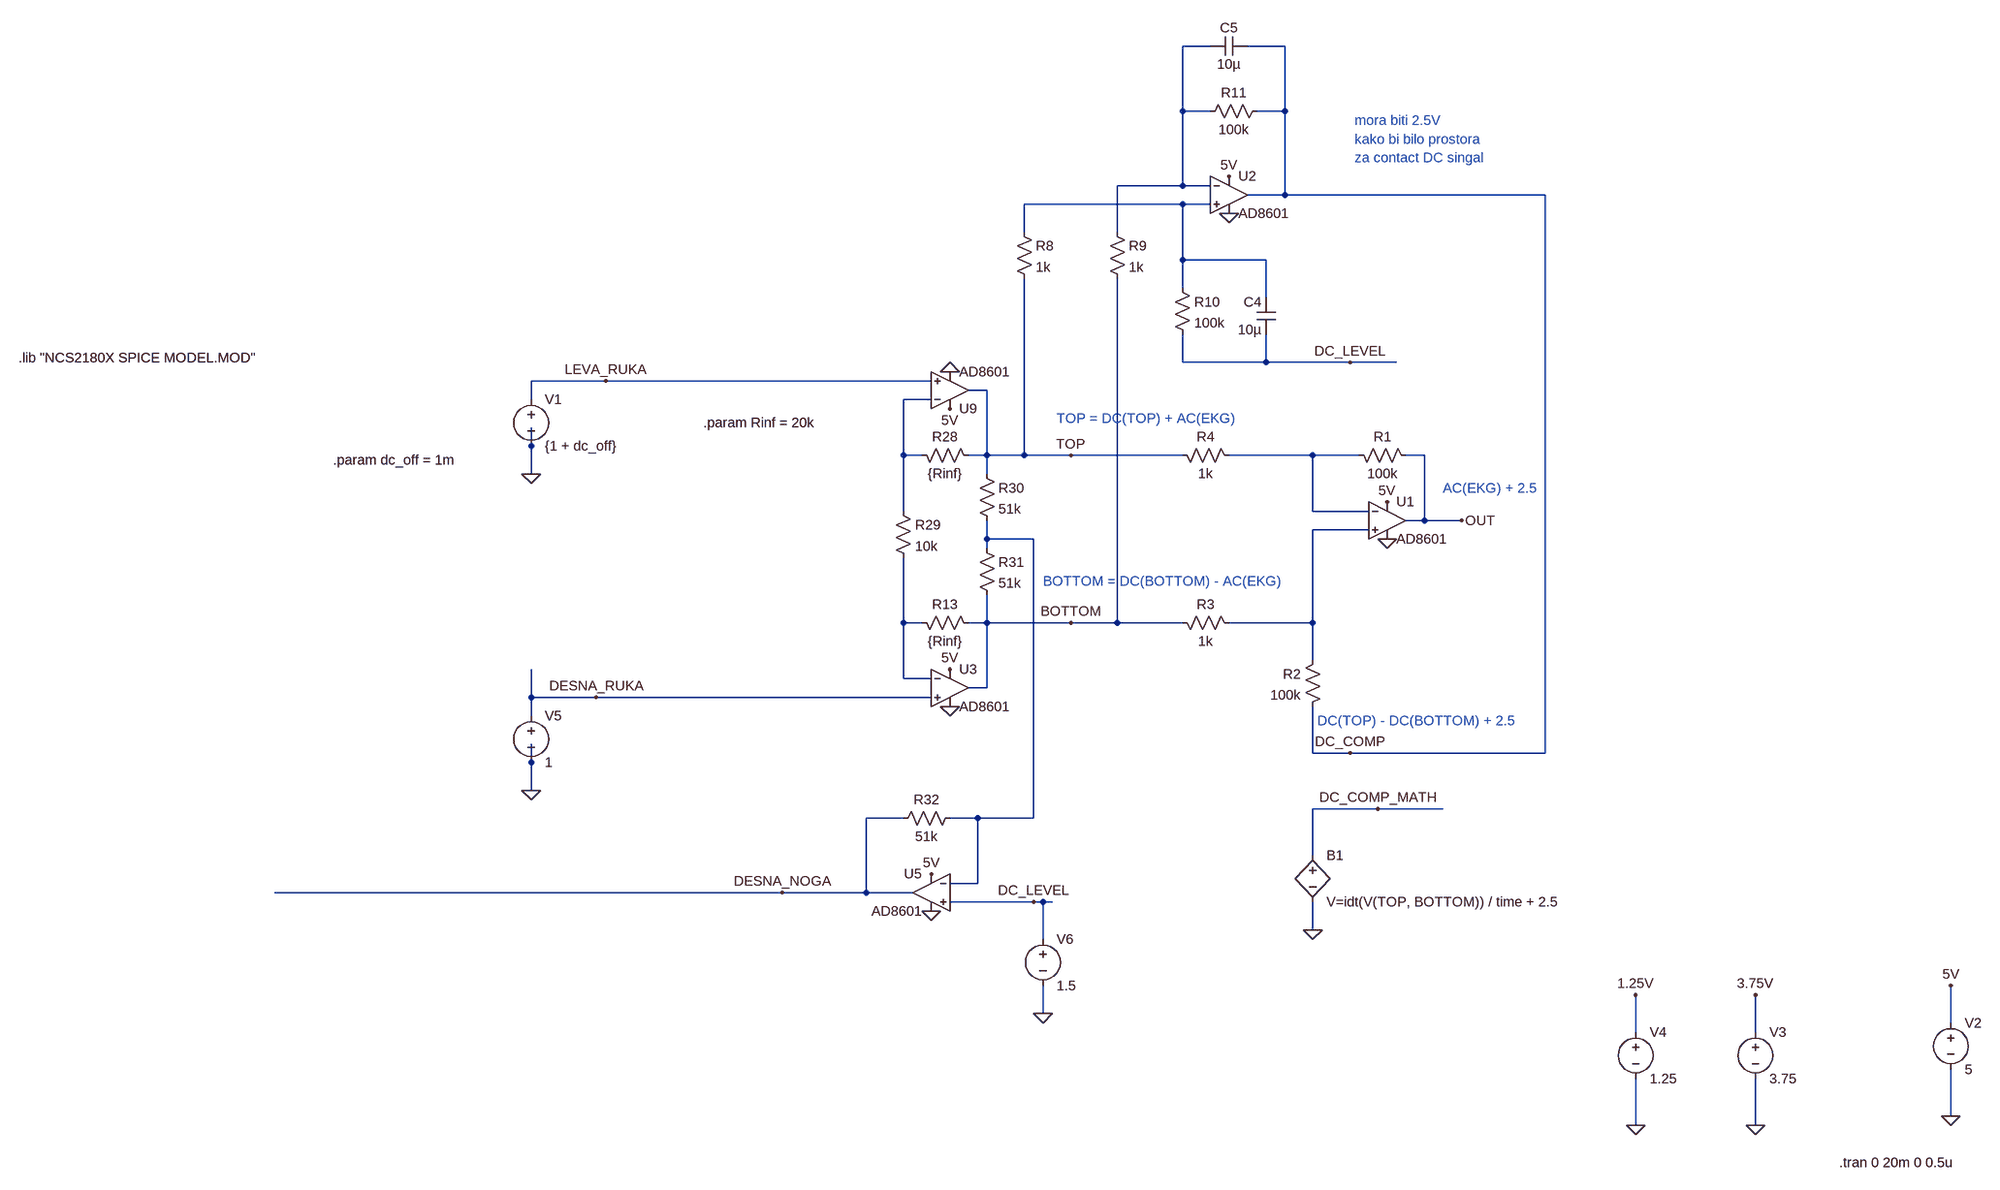
[diagram p0: schematic DC_compensation.asc]
DC_compensation.asc, the LTspice schematic file:
Version 4
SHEET 1 2972 1716
WIRE 0 -736 -48 -736
WIRE 128 -736 64 -736
WIRE -48 -624 -48 -736
WIRE 0 -624 -48 -624
WIRE 128 -624 128 -736
WIRE 128 -624 80 -624
WIRE -48 -496 -48 -624
WIRE -48 -496 -160 -496
WIRE 0 -496 -48 -496
WIRE 128 -480 128 -624
WIRE 128 -480 64 -480
WIRE 576 -480 128 -480
WIRE -48 -464 -320 -464
WIRE 0 -464 -48 -464
WIRE -320 -416 -320 -464
WIRE -160 -416 -160 -496
WIRE -48 -368 -48 -464
WIRE 96 -368 -48 -368
WIRE -48 -320 -48 -368
WIRE 96 -304 96 -368
WIRE -48 -192 -48 -240
WIRE 96 -192 96 -240
WIRE 96 -192 -48 -192
WIRE 240 -192 96 -192
WIRE 320 -192 240 -192
WIRE -1040 -160 -1168 -160
WIRE -480 -160 -1040 -160
WIRE -384 -144 -416 -144
WIRE -1168 -128 -1168 -160
WIRE -480 -128 -528 -128
WIRE -1168 -48 -1168 -80
WIRE -528 -32 -528 -128
WIRE -496 -32 -528 -32
WIRE -384 -32 -384 -144
WIRE -384 -32 -416 -32
WIRE -320 -32 -320 -336
WIRE -320 -32 -384 -32
WIRE -240 -32 -320 -32
WIRE -48 -32 -240 -32
WIRE 176 -32 32 -32
WIRE 256 -32 176 -32
WIRE 368 -32 336 -32
WIRE -1168 0 -1168 -48
WIRE -384 0 -384 -32
WIRE -528 64 -528 -32
WIRE 176 64 176 -32
WIRE 272 64 176 64
WIRE 368 80 368 -32
WIRE 368 80 336 80
WIRE 432 80 368 80
WIRE 272 96 176 96
WIRE -384 112 -384 80
WIRE -304 112 -384 112
WIRE -384 128 -384 112
WIRE -528 256 -528 144
WIRE -496 256 -528 256
WIRE -384 256 -384 208
WIRE -384 256 -416 256
WIRE -240 256 -384 256
WIRE -160 256 -160 -336
WIRE -160 256 -240 256
WIRE -48 256 -160 256
WIRE 176 256 176 96
WIRE 176 256 32 256
WIRE 176 320 176 256
WIRE -528 352 -528 256
WIRE -480 352 -528 352
WIRE -384 368 -384 256
WIRE -384 368 -416 368
WIRE -1168 384 -1168 336
WIRE -1056 384 -1168 384
WIRE -480 384 -1056 384
WIRE -1168 416 -1168 384
WIRE 176 480 176 400
WIRE 240 480 176 480
WIRE 576 480 576 -480
WIRE 576 480 240 480
WIRE -1168 496 -1168 464
WIRE -1168 544 -1168 496
WIRE 288 576 176 576
WIRE 400 576 288 576
WIRE -528 592 -592 592
WIRE -400 592 -448 592
WIRE -304 592 -304 112
WIRE -304 592 -400 592
WIRE 176 656 176 576
WIRE -400 704 -400 592
WIRE -400 704 -448 704
WIRE -736 720 -1616 720
WIRE -592 720 -592 592
WIRE -592 720 -736 720
WIRE -512 720 -592 720
WIRE -304 736 -448 736
WIRE -288 736 -304 736
WIRE -272 736 -288 736
WIRE 176 784 176 736
WIRE -288 800 -288 736
WIRE -288 928 -288 880
WIRE 1760 944 1760 880
WIRE 1168 960 1168 896
WIRE 1424 960 1424 896
WIRE 1760 1104 1760 1024
WIRE 1168 1120 1168 1040
WIRE 1424 1120 1424 1040
FLAG -448 -176 0
FLAG -448 400 0
FLAG 1760 1104 0
FLAG 1760 880 5V
FLAG 304 112 0
FLAG -480 752 0
FLAG -736 720 DESNA_NOGA
FLAG -1040 -160 LEVA_RUKA
FLAG -1056 384 DESNA_RUKA
FLAG -480 688 5V
FLAG -448 336 5V
FLAG 304 48 5V
FLAG -448 -112 5V
FLAG 32 -448 0
FLAG 32 -512 5V
FLAG 1424 1120 0
FLAG 1424 896 3.75V
FLAG 1168 1120 0
FLAG 1168 896 1.25V
FLAG -240 -32 TOP
FLAG -240 256 BOTTOM
FLAG 432 80 OUT
FLAG 240 480 DC_COMP
FLAG 176 784 0
FLAG 288 576 DC_COMP_MATH
FLAG 240 -192 DC_LEVEL
FLAG -304 736 DC_LEVEL
FLAG -1168 0 0
FLAG -1168 544 0
FLAG -288 928 0
SYMBOL voltage 1760 928 R0
WINDOW 123 0 0 Left 0
WINDOW 39 0 0 Left 0
SYMATTR InstName V2
SYMATTR Value 5
SYMBOL res 240 -48 M90
WINDOW 0 0 56 VBottom 2
WINDOW 3 32 56 VTop 2
SYMATTR InstName R1
SYMATTR Value 100k
SYMBOL res 192 304 M0
SYMATTR InstName R2
SYMATTR Value 100k
SYMBOL res 48 272 M270
WINDOW 0 32 56 VTop 2
WINDOW 3 0 56 VBottom 2
SYMATTR InstName R3
SYMATTR Value 1k
SYMBOL res 48 -16 M270
WINDOW 0 32 56 VTop 2
WINDOW 3 0 56 VBottom 2
SYMATTR InstName R4
SYMATTR Value 1k
SYMBOL res -400 -16 M270
WINDOW 0 32 56 VTop 2
WINDOW 3 0 56 VBottom 2
SYMATTR InstName R28
SYMATTR Value {Rinf}
SYMBOL res -544 48 R0
SYMATTR InstName R29
SYMATTR Value 10k
SYMBOL res -400 -16 R0
SYMATTR InstName R30
SYMATTR Value 51k
SYMBOL res -400 112 R0
SYMATTR InstName R31
SYMATTR Value 51k
SYMBOL res -432 576 R90
WINDOW 0 0 56 VBottom 2
WINDOW 3 32 56 VTop 2
SYMATTR InstName R32
SYMATTR Value 51k
SYMBOL res -336 -432 R0
SYMATTR InstName R8
SYMATTR Value 1k
SYMBOL res -176 -432 R0
SYMATTR InstName R9
SYMATTR Value 1k
SYMBOL res -64 -336 R0
SYMATTR InstName R10
SYMATTR Value 100k
SYMBOL res 96 -640 R90
WINDOW 0 0 56 VBottom 2
WINDOW 3 32 56 VTop 2
SYMATTR InstName R11
SYMATTR Value 100k
SYMBOL cap 112 -240 R180
WINDOW 0 24 56 Left 2
WINDOW 3 24 8 Left 2
SYMATTR InstName C4
SYMATTR Value 10µ
SYMBOL cap 0 -720 R270
WINDOW 0 32 32 VTop 2
WINDOW 3 0 32 VBottom 2
SYMATTR InstName C5
SYMATTR Value 10µ
SYMBOL res -400 272 M270
WINDOW 0 32 56 VTop 2
WINDOW 3 0 56 VBottom 2
SYMATTR InstName R13
SYMATTR Value {Rinf}
SYMBOL voltage 1424 944 R0
WINDOW 123 0 0 Left 0
WINDOW 39 0 0 Left 0
SYMATTR InstName V3
SYMATTR Value 3.75
SYMBOL voltage 1168 944 R0
WINDOW 123 0 0 Left 0
WINDOW 39 0 0 Left 0
SYMATTR InstName V4
SYMATTR Value 1.25
SYMBOL bv 176 640 R0
SYMATTR InstName B1
SYMATTR Value V=idt(V(TOP, BOTTOM)) / time + 2.5
SYMBOL OpAmps\\AD8601 -448 -80 M180
SYMATTR InstName U9
SYMBOL OpAmps\\AD8601 -448 304 R0
SYMATTR InstName U3
SYMBOL OpAmps\\AD8601 -480 656 M0
SYMATTR InstName U5
SYMBOL OpAmps\\AD8601 304 16 R0
SYMATTR InstName U1
SYMBOL OpAmps\\AD8601 32 -544 R0
SYMATTR InstName U2
SYMBOL voltage -1168 -144 R0
WINDOW 123 0 0 Left 0
WINDOW 39 0 0 Left 0
SYMATTR InstName V1
SYMATTR Value {1 + dc_off}
SYMBOL voltage -1168 400 R0
WINDOW 123 0 0 Left 0
WINDOW 39 0 0 Left 0
SYMATTR InstName V5
SYMATTR Value 1
SYMBOL voltage -288 784 R0
WINDOW 123 0 0 Left 0
WINDOW 39 0 0 Left 0
SYMATTR InstName V6
SYMATTR Value 1.5
TEXT 1568 1184 Left 2 !.tran 0 20m 0 0.5u
TEXT -2056 -200 Left 2 !.lib "NCS2180X SPICE MODEL.MOD"
TEXT -872 -88 Left 2 !.param Rinf = 20k
TEXT 248 -608 Left 2 ;mora biti 2.5V
TEXT 248 -576 Left 2 ;kako bi bilo prostora
TEXT 248 -544 Left 2 ;za contact DC singal
TEXT 184 424 Left 2 ;DC(TOP) - DC(BOTTOM) + 2.5
TEXT -264 -96 Left 2 ;TOP = DC(TOP) + AC(EKG)
TEXT -288 184 Left 2 ;BOTTOM = DC(BOTTOM) - AC(EKG)
TEXT 400 24 Left 2 ;AC(EKG) + 2.5
TEXT -1512 -24 Left 2 !.param dc_off = 1m

The netlist it stands for:
* DC_compensation.asc
V2 5V 0 5
R1 N004 OUT 100k
R2 N005 DC_COMP 100k
R3 N005 BOTTOM 1k
R4 N004 TOP 1k
R28 TOP N003 {Rinf}
R29 N003 N007 10k
R30 TOP N006 51k
R31 N006 BOTTOM 51k
R32 N006 DESNA_NOGA 51k
R8 N002 TOP 1k
R9 N001 BOTTOM 1k
R10 N002 DC_LEVEL 100k
R11 DC_COMP N001 100k
C4 DC_LEVEL N002 10µ
C5 N001 DC_COMP 10µ
R13 BOTTOM N007 {Rinf}
V3 3.75V 0 3.75
V4 1.25V 0 1.25
B1 DC_COMP_MATH 0 V=idt(V(TOP, BOTTOM)) / time + 2.5
XU9 LEVA_RUKA N003 5V 0 TOP AD8601  ; pins In+ In- V+ V- OUT
XU3 DESNA_RUKA N007 5V 0 BOTTOM AD8601  ; pins In+ In- V+ V- OUT
XU5 DC_LEVEL N006 5V 0 DESNA_NOGA AD8601  ; pins In+ In- V+ V- OUT
XU1 N005 N004 5V 0 OUT AD8601  ; pins In+ In- V+ V- OUT
XU2 N002 N001 5V 0 DC_COMP AD8601  ; pins In+ In- V+ V- OUT
V1 LEVA_RUKA 0 {1 + dc_off}
V5 DESNA_RUKA 0 1
V6 DC_LEVEL 0 1.5
.tran 0 20m 0 0.5u
.lib "NCS2180X SPICE MODEL.MOD"
.param Rinf = 20k
* mora biti 2.5V
* kako bi bilo prostora
* za contact DC singal
* DC(TOP) - DC(BOTTOM) + 2.5
* TOP = DC(TOP) + AC(EKG)
* BOTTOM = DC(BOTTOM) - AC(EKG)
* AC(EKG) + 2.5
.param dc_off = 1m
.backanno
.end